# Altium project Ozgun_UKB_2025-2026.PrjPcb (part 1 of 4)
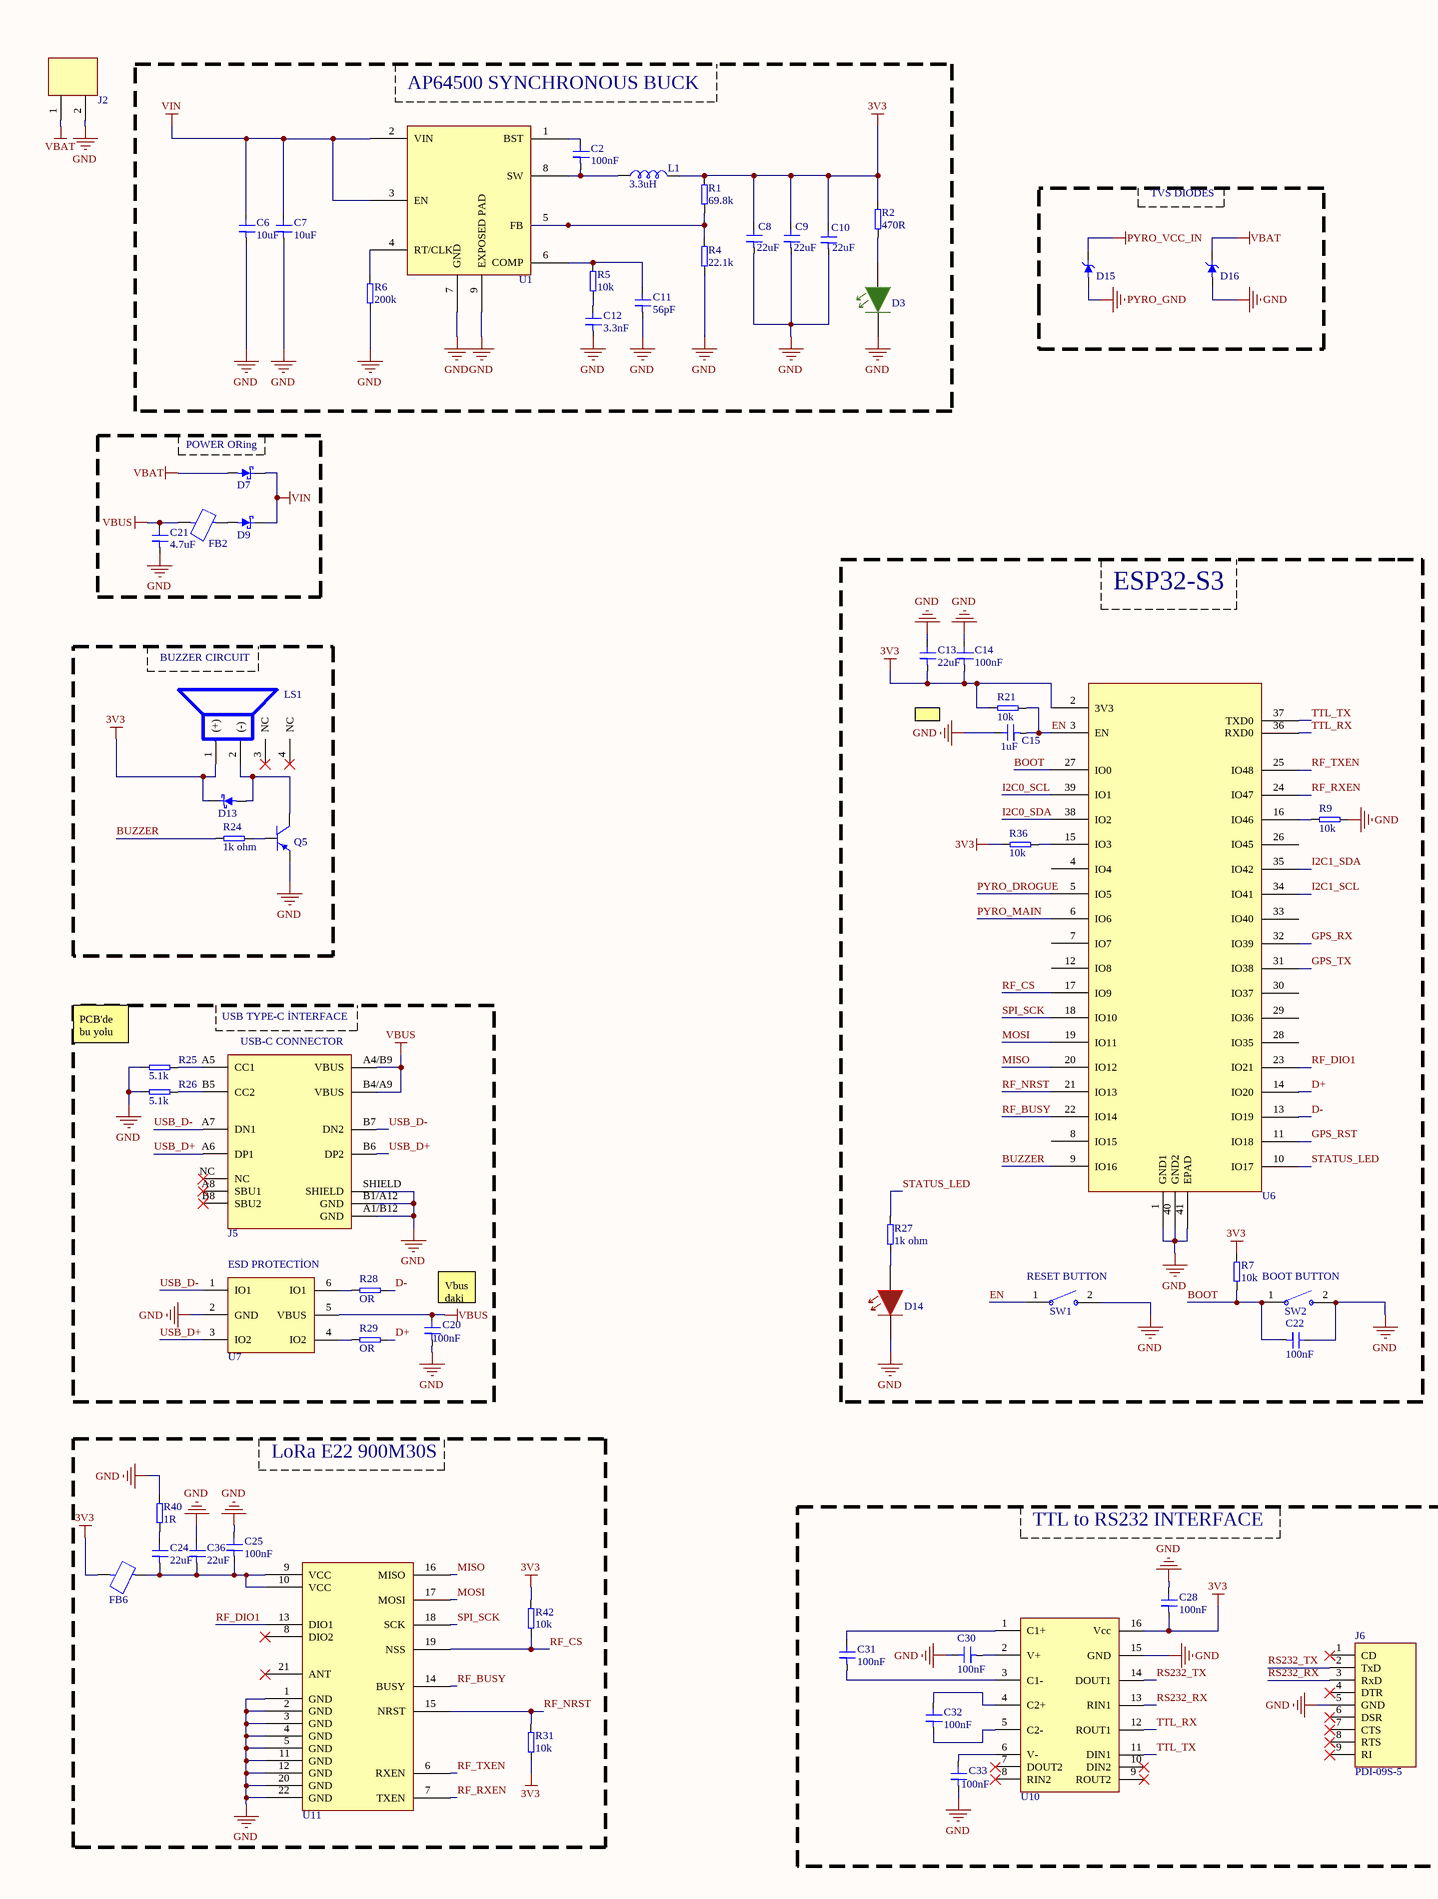
[diagram p0: Ucus_Kontrol_Bilgisayari.SchDoc, left]
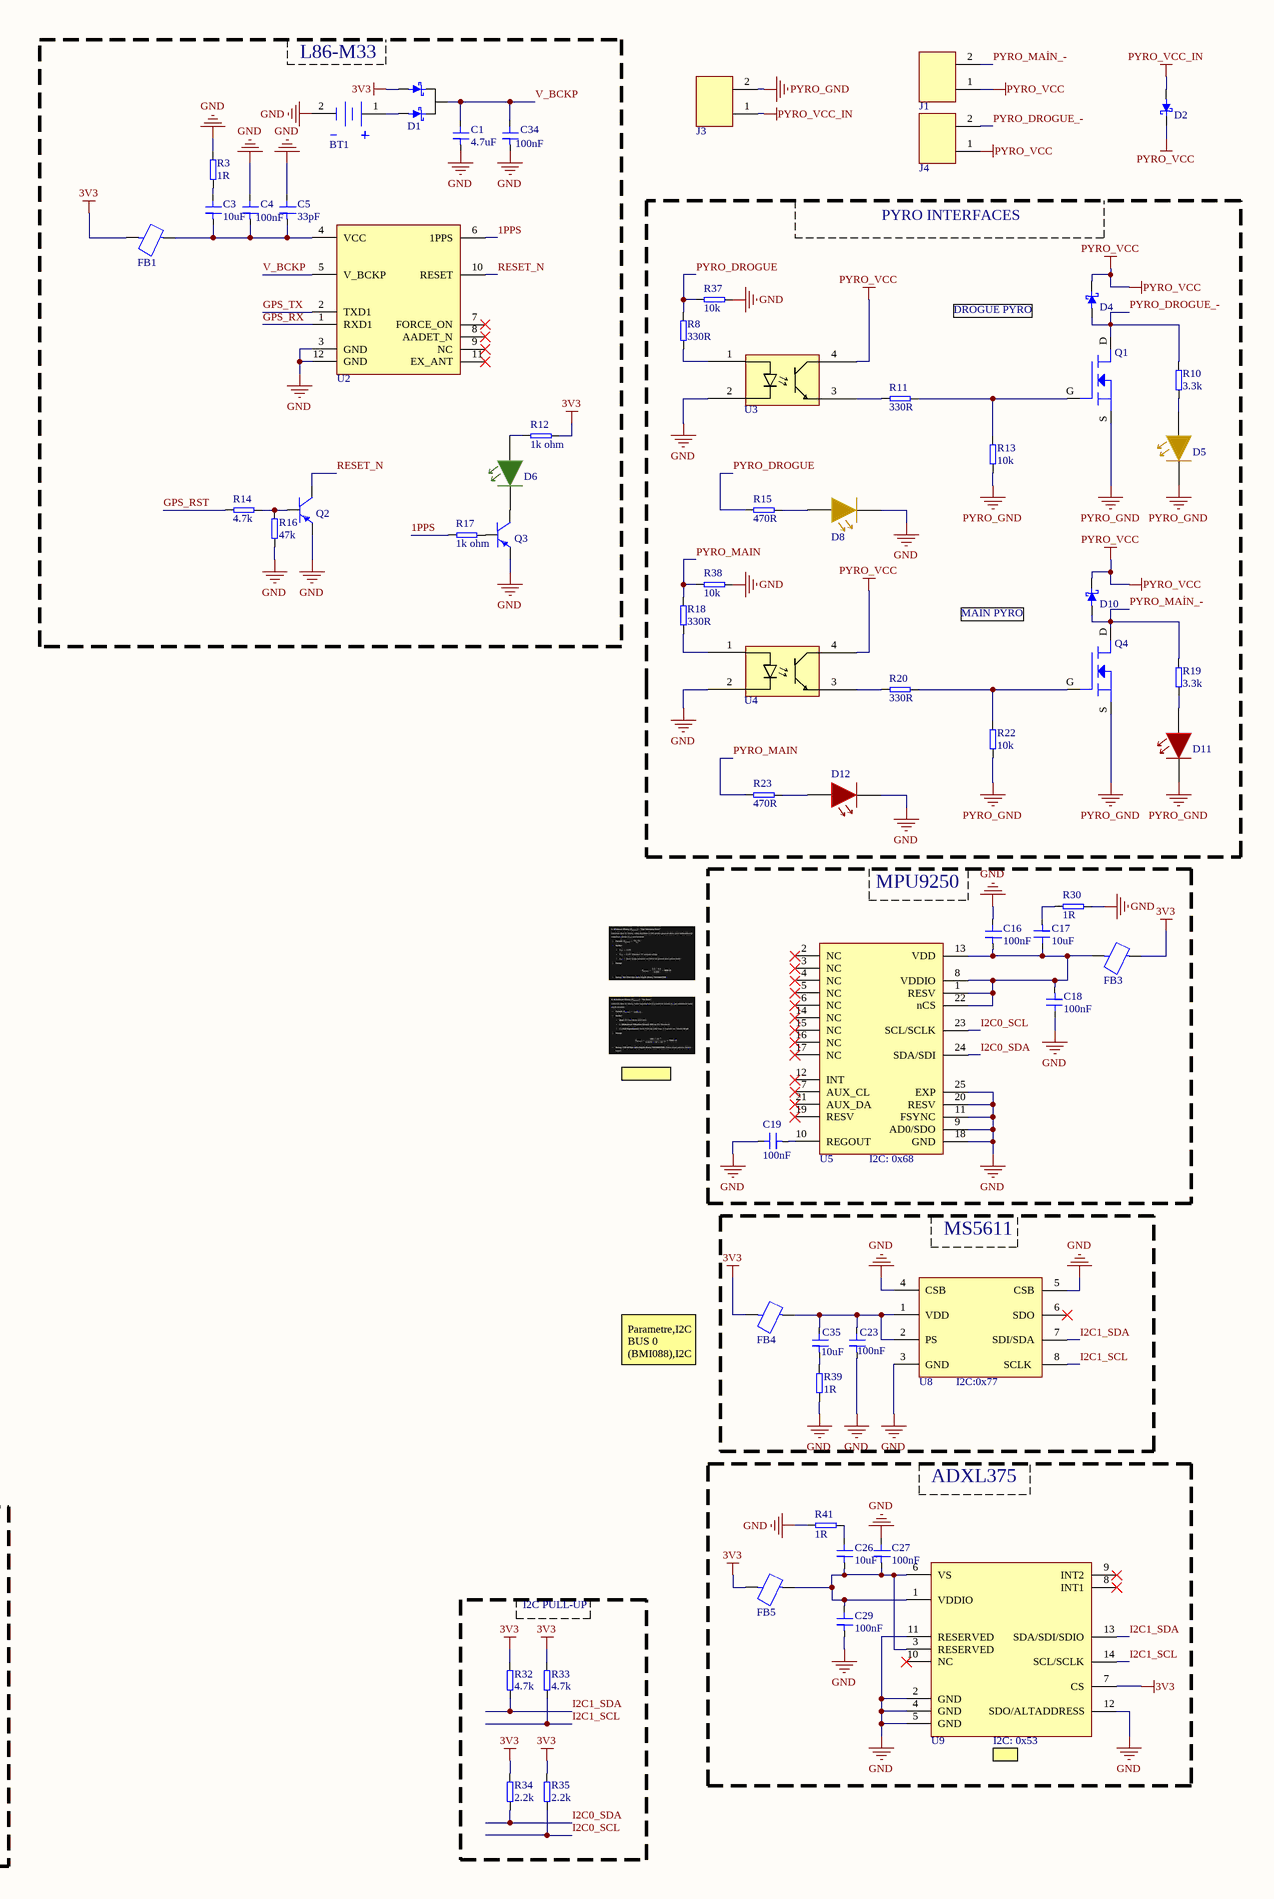
[diagram p1: Ucus_Kontrol_Bilgisayari.SchDoc, right]
1 sheet, 127 parts. Net scope: global (net labels, ports and power ports of the same name join across sheets).
Board file: Ucus_Kontrol_Bilgisayari.PcbDoc

## Sheet Ucus_Kontrol_Bilgisayari.SchDoc: AZAK ROKET TAKIMI ÖZGÜN UÇUŞ KONTROL BİLGİSAYARI
size A2; DrawnBy: Mehmet Ali İNANOĞLU; Revision: V1.0; SheetNumber: 1; SheetTotal: 1

### Parts
BT1  R2032-1F2DV - 3V Li-MnO2  [CR2032]  (value not drawn)
C1  4.7uF  [0603 CAP SER]
C2  100nF  [0603 CAP SER]
C3  10uF  [0805 CAP SER]
C4  100nF  [0603 CAP SER]
C5  33pF  [0603 CAP SER]
C6  10uF  [1206 CAP SER]
C7  10uF  [1206 CAP SER]
C8  22uF  [1206 CAP SER]
C9  22uF  [1206 CAP SER]
C10  22uF  [1206 CAP SER]
C11  56pF  [0603 CAP SER]
C12  3.3nF  [0603 CAP SER]
C13  22uF  [1206 CAP SER]
C14  100nF  [0603 CAP SER]
C15  1uF  [0603 CAP SER]
C16  100nF  [0603 CAP SER]
C17  10uF  [0805 CAP SER]
C18  100nF  [0603 CAP SER]
C19  100nF  [0603 CAP SER]
C20  100nF  [0603 CAP SER]
C21  4.7uF  [0805 CAP SER]
C22  100nF  [0603 CAP SER]
C23  100nF  [0603 CAP SER]
C24  22uF  [1206 CAP SER]
C25  100nF  [0603 CAP SER]
C26  10uF  [0805 CAP SER]
C27  100nF  [0603 CAP SER]
C28  100nF  [0603 CAP SER]
C29  100nF  [0603 CAP SER]
C30  100nF  [0603 CAP SER]
C31  100nF  [0603 CAP SER]
C32  100nF  [0603 CAP SER]
C33  100nF  [0603 CAP SER]
C34  100nF  [0603 CAP SER]
C35  10uF  [0805 CAP SER]
C36  22uF  [1206 CAP SER]
D1  DIODE SCHOTTKY 2*0.2A 30V SOT23 CATHODE LRC  [SOT-23]  (value not drawn)
D2  Low VF Schottky Rect.  [DO214AA (SMB)]  (value not drawn)
D3  LED SMD 0805 GREEN 18-45mcd 140° WATER CLEAR  [LED 0805 GREEN]  (value not drawn)
D4  DIODE SCHOTTKY 1A 40V SOD123 SMT  [SOD-123]  (value not drawn)
D5  LED SMD 0805 YELLOW 28.5-72mcd 140° WATER CLEAR  [LED 0805 YELLOW]  (value not drawn)
D6  LED SMD 0805 GREEN 18-45mcd 140° WATER CLEAR  [LED 0805 GREEN]  (value not drawn)
D7  DIODE SCHOTTKY 3A 30V DO214AC (SMA) SMT  [DO-214AC 1F]  (value not drawn)
D8  LED SMD 0805 YELLOW 28.5-72mcd 140° WATER CLEAR  [LED 0805 YELLOW]  (value not drawn)
D9  DIODE SCHOTTKY 3A 30V DO214AC (SMA) SMT  [DO-214AC 1F]  (value not drawn)
D10  DIODE SCHOTTKY 1A 40V SOD123 SMT  [SOD-123]  (value not drawn)
D11  LED SMD 0805 RED 45~112mcd 120C  [LED 0805 RED]  (value not drawn)
D12  LED SMD 0805 RED 45~112mcd 120C  [LED 0805 RED]  (value not drawn)
D13  DIODE SCHOTTKY 1A 40V SOD123 SMT  [SOD-123]  (value not drawn)
D14  LED SMD 0805 RED 45~112mcd 120C  [LED 0805 RED]  (value not drawn)
D15  DIODE TVS 1500W 14V DO214AB (SMC) SMT  [DO214AB (SMC)]  (value not drawn)
D16  DIODE TVS 600W 10V DO214AA (SMB) SMT  [DO214AA (SMB)]  (value not drawn)
FB1  FERRİTE BEADS 600 OHM POWER MURATA  [0603 FERRİT BEAD]  (value not drawn)
FB2  FERRITE BEAD 0805 180R 4A SMD  [0805 FERRİT BEAD]  (value not drawn)
FB3  FERRİTE BEADS 600 OHM POWER MURATA  [0603 FERRİT BEAD]  (value not drawn)
FB4  FERRİTE BEADS 600 OHM POWER MURATA  [0603 FERRİT BEAD]  (value not drawn)
FB5  FERRİTE BEADS 600 OHM POWER MURATA  [0603 FERRİT BEAD]  (value not drawn)
FB6  FERRITE BEAD 0805 180R 4A SMD  [0805 FERRİT BEAD]  (value not drawn)
J1  XT30 Konnektör  [XT30]  (value not drawn)
J2  XT30 Konnektör  [XT30]  (value not drawn)
J3  XT30 Konnektör  [XT30]  (value not drawn)
J4  XT30 Konnektör  [XT30]  (value not drawn)
J5  CONNECTOR USB C R/A TYPE 16P  [USB4105-GF-A]  (value not drawn)
J6  PDI-09S-5  [PDI-09R-5]
L1  3.3uH  [SRP7030-3R3M]
LS1  BUZZER MAGNETIC W/O CIRCUIT 3.6V 2.31-KHZ SMT  [MTS7525A04LM]  (value not drawn)
Q1  MOSFET DIS.84A 25V N-CH TDSON-8 OPTIMOS SMT  [PG-TDSON-8]  (value not drawn)
Q2  TRANSISTOR DIS.600mA 40V NPN SOT23 GEN. SMT  [SOT-23]  (value not drawn)
Q3  TRANSISTOR DIS.600mA 40V NPN SOT23 GEN. SMT  [SOT-23]  (value not drawn)
Q4  MOSFET DIS.84A 25V N-CH TDSON-8 OPTIMOS SMT  [PG-TDSON-8]  (value not drawn)
Q5  TRANSISTOR DIS.600mA 40V NPN SOT23 GEN. SMT  [SOT-23]  (value not drawn)
R1  69.8k  [0603 RES]
R2  470R  [0603 RES]
R3  1R  [0603 RES]
R4  22.1k  [0603 RES]
R5  10k  [0603 RES]
R6  200k  [0603 RES]
R7  10k  [0603 RES]
R8  330R  [0603 RES]
R9  10k  [0603 RES]
R10  3.3k  [0603 RES]
R11  330R  [0603 RES]
R12  1k ohm  [0603 RES]
R13  10k  [0603 RES]
R14  4.7k  [0603 RES]
R15  470R  [0603 RES]
R16  47k  [0603 RES]
R17  1k ohm  [0603 RES]
R18  330R  [0603 RES]
R19  3.3k  [0603 RES]
R20  330R  [0603 RES]
R21  10k  [0603 RES]
R22  10k  [0603 RES]
R23  470R  [0603 RES]
R24  1k ohm  [0603 RES]
R25  5.1k  [0603 RES]
R26  5.1k  [0603 RES]
R27  1k ohm  [0603 RES]
R28  OR  [0603 RES]
R29  OR  [0603 RES]
R30  1R  [0603 RES]
R31  10k  [0603 RES]
R32  4.7k  [0603 RES]
R33  4.7k  [0603 RES]
R34  2.2k  [0603 RES]
R35  2.2k  [0603 RES]
R36  10k  [0603 RES]
R37  10k  [0603 RES]
R38  10k  [0603 RES]
R39  1R  [0603 RES]
R40  1R  [0603 RES]
R41  1R  [0603 RES]
R42  10k  [0603 RES]
SW1  SWITCH TACT 3.65x6.10 2.50mm 180gF SMT V/T  [L-KLS7-TS3611-2.5-180-T]  (value not drawn)
SW2  SWITCH TACT 3.65x6.10 2.50mm 180gF SMT V/T  [L-KLS7-TS3611-2.5-180-T]  (value not drawn)
U1  Buck Switching Regulator IC Positive Adjustable 0.8V 1 Output 5A 8-SOIC (0.154", 3.90mm Width) Exposed Pad  [SO-8EP]  (value not drawn)
U2  L86-M33  [L86-M33]  (value not drawn)
U3  IC-816 OPTOISO SMD4 LITEON  [SMD4]  (value not drawn)
U4  IC-816 OPTOISO SMD4 LITEON  [SMD4]  (value not drawn)
U5  IMU ACCEL/GYRO/MAG I2C/SPI 24QFN  [TFQFN-24]  (value not drawn)
U6  Bluetooth, WiFi 802.11b/g/n, Bluetooth v5.0 Transceiver Module 2.4GHz Antenna Not Included, U.FL Surface Mount  [ESP32-S3_WROOM-1U]  (value not drawn)
U7  DIODE TVS 5.25VWM 17VC SOT23-6  [SOT23-6L]  (value not drawn)
U8  MS5611-01BA03  [MS5611-01BA03]  (value not drawn)
U9  Accelerometer X, Y, Z Axis ±200g 0.05Hz ~ 1.6kHz 14-LGA (3x5)  [LGA-14]  (value not drawn)
U10  IC-3232 DRVR/RCVR MLTCH RS232 16TSSOP  [TSSOP-16]  (value not drawn)
U11  EBYTE Sx1262 E22-900M30S  [E22 900M30S]  (value not drawn)

### Blocks framed on the sheet
AP64500 SYNCHRONOUS BUCK: C2 C6-C12 D3 L1 R1 R2 R4-R6 U1
L86-M33: BT1 C1 C3-C5 C34 D1 D6 FB1 Q2 Q3 R3 R12 R14 R16 R17 U2
TVS DIODES: D15 D16
PYRO INTERFACES: D4 D5 D8 D10-D12 Q1 Q4 R8 R10 R11 R13 R15 R18-R20 R22 R23 R37 R38 U3 U4
POWER ORing: C21 D7 D9 FB2
ESP32-S3: C13-C15 C22 D14 R7 R9 R21 R27 R36 SW1 SW2 U6
BUZZER CIRCUIT: D13 LS1 Q5 R24
MPU9250: C16-C19 FB3 R30 U5
MS5611: C23 C35 FB4 R39 U8
LoRa E22 900M30S: C24 C25 C36 FB6 R31 R40 R42 U11
ADXL375: C26 C27 C29 FB5 R41 U9
TTL to RS232 INTERFACE: C28 C30-C33 J6 U10
I2C PULL-UP: R32-R35

### Nets
3V3: C8.2 C9.2 C10.2 C13.1 C14.1 C28.1 D1.1 D13.K FB1.1 FB3.2 FB4.1 FB5.1 FB6.1 L1.2 LS1.1((+)) R1.2 R2.2 R7.1 R12.2 R21.2 R31.1 R32.2 R33.2 R34.2 R35.2 R36.1 R42.2 U6.2(3V3) U9.7(CS) U10.16(Vcc)
GND: BT1.2 C1.1 C4.2 C5.2 C6.1 C7.1 C8.1 C9.1 C10.1 C11.1 C12.1 C13.2 C14.2 C15.2 C16.2 C18.2 C19.2 C20.1 C21.1 C22.2 C23.1 C25.2 C27.2 C28.2 C29.1 C30.2 C33.1 C34.1 C36.2 D3.2 D8.2 D12.2 D14.2 D16.A J2.2 J5.A1/B12(GND) J5.B1/A12(GND) J5.SHIELD J6.5(GND) Q2.2(E) Q3.2(E) Q5.2(E) R3.2 R4.1 R6.1 R9.2 R16.1 R25.1 R26.2 R30.2 R37.2 R38.2 R39.2 R40.2 R41.2 SW1.2 SW2.2 U1.7(GND) U1.9(EXPOSED_PAD) U2.3(GND) U2.12(GND) U3.2(KATOT) U4.2(KATOT) U5.9(AD0/SDO) U5.11(FSYNC) U5.18(GND) U5.20(RESV) U5.25(EXP) U6.1(GND1) U6.40(GND2) U6.41(EPAD) U7.2(GND) U8.3(GND) U8.4(CSB) U8.5(CSB) U9.2(GND) U9.4(GND) U9.5(GND) U9.11(RESERVED) U9.12(SDO/ALTADDRESS) U10.15(GND) U11.1(GND) U11.2(GND) U11.3(GND) U11.4(GND) U11.5(GND) U11.11(GND) U11.12(GND) U11.20(GND) U11.22(GND)
PYRO_GND: D5.2 D11.2 D15.A J3.2 Q1.S Q4.S R13.1 R22.1
PYRO_VCC: D2.K D4.K D10.K J1.1 J4.1 U3.4(KOLLEKTÖR) U4.4(KOLLEKTÖR)
PYRO_VCC_IN: D2.A D15.K J3.1
VBAT: D7.A D16.K J2.1
VBUS: C20.2 C21.2 FB2.1 J5.A4/B9(VBUS) J5.B4/A9(VBUS) U7.5(VBUS)
VIN: C6.2 C7.2 D7.K D9.K U1.2(VIN) U1.3(EN)
1PPS: R17.1 U2.6(1PPS)
BOOT: C22.1 R7.2 SW2.1 U6.27(IO0)
BUZZER: R24.1 U6.9(IO16)
D+: R29.2 U6.14(IO20)
D-: R28.2 U6.13(IO19)
EN: C15.1 R21.1 SW1.1 U6.3(EN)
GPS_RST: R14.1 U6.11(IO18)
GPS_RX: U2.1(RXD1) U6.32(IO39)
GPS_TX: U2.2(TXD1) U6.31(IO38)
I2C0_SCL: R35.1 U5.23(SCL/SCLK) U6.39(IO1)
I2C0_SDA: R34.1 U5.24(SDA/SDI) U6.38(IO2)
I2C1_SCL: R33.1 U6.34(IO41) U8.8(SCLK) U9.14(SCL/SCLK)
I2C1_SDA: R32.1 U6.35(IO42) U8.7(SDI/SDA) U9.13(SDA/SDI/SDIO)
MISO: U6.20(IO12) U11.16(MISO)
MOSI: U6.19(IO11) U11.17(MOSI)
PYRO_DROGUE: R8.2 R15.1 R37.1 U6.5(IO5)
PYRO_DROGUE_-: D4.A J4.2 Q1.D R10.2
PYRO_MAIN: R18.2 R23.1 R38.1 U6.6(IO6)
PYRO_MAİN_-: D10.A J1.2 Q4.D R19.2
RESET_N: Q2.3(C) U2.10(RESET)
RF_BUSY: U6.22(IO14) U11.14(BUSY)
RF_CS: R42.1 U6.17(IO9) U11.19(NSS)
RF_DIO1: U6.23(IO21) U11.13(DIO1)
RF_NRST: R31.2 U6.21(IO13) U11.15(NRST)
RF_RXEN: U6.24(IO47) U11.7(TXEN)
RF_TXEN: U6.25(IO48) U11.6(RXEN)
RS232_RX: J6.3(RxD) U10.13(RIN1)
RS232_TX: J6.2(TxD) U10.14(DOUT1)
SPI_SCK: U6.18(IO10) U11.18(SCK)
STATUS_LED: R27.2 U6.10(IO17)
TTL_RX: U6.36(RXD0) U10.12(ROUT1)
TTL_TX: U6.37(TXD0) U10.11(DIN1)
USB_D+: J5.A6(DP1) J5.B6(DP2) U7.3(IO2)
USB_D-: J5.A7(DN1) J5.B7(DN2) U7.1(IO1)
V_BCKP: C1.2 C34.2 D1.3 U2.5(V_BCKP)
NetBT1_1: BT1.1 D1.2
NetC2_1: C2.1 L1.1 U1.8(SW)
NetC2_2: C2.2 U1.1(BST)
NetC3_1: C3.1 C4.1 C5.1 FB1.2 U2.4(VCC)
NetC3_2: C3.2 R3.1
NetC11_2: C11.2 R5.2 U1.6(COMP)
NetC12_2: C12.2 R5.1
NetC16_1: C16.1 C17.2 C18.1 FB3.1 U5.1(RESV) U5.8(VDDIO) U5.13(VDD) U5.22(nCS)
NetC17_1: C17.1 R30.1
NetC19_1: C19.1 U5.10(REGOUT)
NetC23_2: C23.2 C35.2 FB4.2 U8.1(VDD) U8.2(PS)
NetC24_1: C24.1 C25.1 C36.1 FB6.2 U11.9(VCC) U11.10(VCC)
NetC24_2: C24.2 R40.1
NetC26_1: C26.1 C27.1 C29.2 FB5.2 U9.1(VDDIO) U9.3(RESERVED) U9.6(VS)
NetC26_2: C26.2 R41.1
NetC30_1: C30.1 U10.2(V+)
NetC31_1: C31.1 U10.3(C1-)
NetC31_2: C31.2 U10.1(C1+)
NetC32_1: C32.1 U10.5(C2-)
NetC32_2: C32.2 U10.4(C2+)
NetC33_2: C33.2 U10.6(V-)
NetC35_1: C35.1 R39.1
NetD3_1: D3.1 R2.1
NetD5_1: D5.1 R10.1
NetD6_1: D6.1 R12.1
NetD6_2: D6.2 Q3.3(C)
NetD8_1: D8.1 R15.2
NetD9_A: D9.A FB2.2
NetD11_1: D11.1 R19.1
NetD12_1: D12.1 R23.2
NetD13_A: D13.A LS1.2((-)) Q5.3(C)
NetD14_1: D14.1 R27.1
NetJ5_A5: J5.A5(CC1) R25.2
NetJ5_B5: J5.B5(CC2) R26.1
NetQ1_G: Q1.G R11.1 R13.2
NetQ2_1: Q2.1(B) R14.2 R16.2
NetQ3_1: Q3.1(B) R17.2
NetQ4_G: Q4.G R20.1 R22.2
NetQ5_1: Q5.1(B) R24.2
NetR1_1: R1.1 R4.2 U1.5(FB)
NetR6_2: R6.2 U1.4(RT/CLK)
NetR8_1: R8.1 U3.1(ANOT)
NetR9_1: R9.1 U6.16(IO46)
NetR11_2: R11.2 U3.3(EMİTER)
NetR18_1: R18.1 U4.1(ANOT)
NetR20_2: R20.2 U4.3(EMİTER)
NetR28_1: R28.1 U7.6(IO1)
NetR29_1: R29.1 U7.4(IO2)
NetR36_2: R36.2 U6.15(IO3)

Not connected (* = marked no-connect by the designer): J5 A8(SBU1)* B8(SBU2)* NC*; J6 1(CD)* 4(DTR)* 6(DSR)* 7(CTS)* 8(RTS)* 9(RI)*; LS1 3(NC)* 4(NC)*; U2 7(FORCE_ON)* 8(AADET_N)* 9(NC)* 11(EX_ANT)*; U5 2(NC)* 3(NC)* 4(NC)* 5(NC)* 6(NC)* 7(AUX_CL)* 12(INT)* 14(NC)* 15(NC)* 16(NC)* 17(NC)* 19(RESV)* 21(AUX_DA)*; U6 4(IO4) 7(IO7) 8(IO15) 12(IO8) 26(IO45) 28(IO35) 29(IO36) 30(IO37) 33(IO40); U8 6(SDO)*; U9 8(INT1)* 9(INT2)* 10(NC)*; U10 7(DOUT2)* 8(RIN2)* 9(ROUT2)* 10(DIN2)*; U11 8(DIO2)* 21(ANT)*

### Notes on the sheet
- (near R37) toplam mcu gpio yükü 9.2mA
- (near R37) opto ledi 6.4mA de çalışır
- DROGUE PYRO
- (near R13) gösterge ledlerini akımı yaklaşık 2.8mA
- (near R11) MOSFET açılırken 330 direçten yaklaşık 25mA geçer opto transistörü 50mA tepe değeri
  MOSFET tamamen açıldıktan sonra sadece gate toprak direnci 10k üzerinden 0.8mA akar.
- (near Q1) 7.4V                 8.4V
  1ohm -    7.4A                  8.4A
  1.5ohm - 4.9A                  5.6A
  2ohm -    3.7A                  4.2A
- diyot eklenmelimi pyro klemenslerine paralel
- MAİN PYRO
- 10K 3.3 e bağlanması yeterli fakat 1uF EN pinine olabildiğince yakın olmalı
- USB TYPE-C İNTERFACE
- (near R25) PCB'de bu yolu çizerken, VBUS hattını ESD entegresinin 5. pinine "T" şeklinde bağlama.
  Yolu Konektörden çıkar, ESD'nin 5. pininin ÜZERİNDEN GEÇİR (veya pedine değdirip devam et), sonra Ferrit'e götür.
  ESD'nin GND bağlantısını (Pin 2) çok sağlam (kısa ve kalın) yap. Yoksa koruma çalışmaz.
  konektör ile esd yi yakın  koy
  D+ D- hatları eşit uzunluk olmalı
- (near J5) USB-C CONNECTOR
- https://www.ti.com/lit/an/slva689/slva689.pdf?ts=1764831959382&ref_url=https%253A%252F%252Fwww.google.com%252F
- (near U5) I2C: 0x68
- (near U7) ESD PROTECTİON
- (near C20) Vbus daki 100nF pine çok yakın olmalı konektör Vbus ı ile gnd arasına en kısa yoldan bağlanmalı
- (near SW1) RESET BUTTON
- BOOT BUTTON
- Parametre,I2C BUS 0 (BMI088),I2C BUS 1 (ADXL+MS)
  Pull-Up Direnci,2.2 kΩ,4.7 kΩ
  Öncelik,Hız & Gürültü Bağışıklığı,Güç Tasarrufu & Yeterlilik
  Yükselme Süresi (tr​),93 ns (Çok Hızlı),200 ns (Standart)
  Akım Sarfiyatı (Low),1.5 mA,0.7 mA
  Kullanım Amacı,Flight Control Loop (Yüksek Frekans),Logging & Events (Orta Frekans)
  tr ≈ 0.85 × 2.2 kΩ × 50 pF ≈ 93 ns (Spec Sayfa 46: Fast-mode için <300 ns,  Fm+ <120
  I_low = 3.3V / 2.2 kΩ ≈ 1.5 mA
  tr ≈ 0.85 × 4.7 kΩ × 50 pF ≈ 200 ns
  I_low = 3.3V / 4.7 kΩ ≈ 0.7 mA
- (near U8) I2C:0x77
- (near U9) I2C: 0x53
- (near U9) İNT pinleri kullanabilirz
  Reserved pin 3 VS pininin temizlenmiş 3.3V tarafına bağlanmalı